# EasyEDA Pro project ProPrj_Dolphin 3D.epro, board PCB3
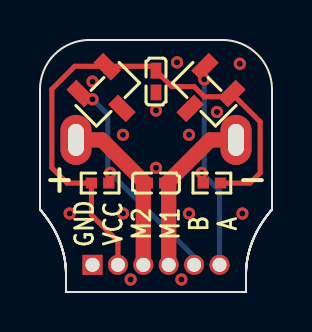
[diagram p7: board, top side]
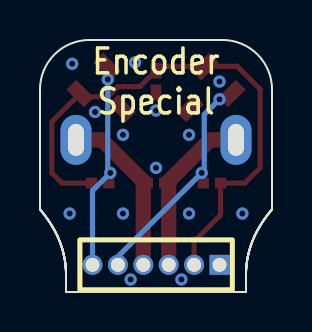
[diagram p8: board, bottom side, seen from below]

Outline 11.6 x 12.61 mm; copper layers: Top Layer, Bottom Layer. Coordinates in mm from the lower left corner of the outline.
Outline path: 0,10.13 arc(0.72,11.89) 2.48,12.61 9.12,12.61 arc(10.88,11.89) 11.6,10.14 11.6,4.13 11.57,4.09 11.52,4.04 11.5,4.01 11.47,3.98 11.45,3.95 11.41,3.89 11.37,3.84 11.35,3.82 11.32,3.78 11.3,3.76 11.26,3.7 11.23,3.65 11.21,3.63 11.19,3.6 11.17,3.57 11.15,3.54 11.13,3.51 11.1,3.46 11.08,3.43 11.05,3.39 11.03,3.35 11.02,3.34 10.99,3.29 10.95,3.22 10.93,3.19 10.91,3.15 10.89,3.11 10.87,3.08 10.86,3.05 10.84,3.03 10.82,2.99 10.8,2.94 10.78,2.89 10.76,2.85 10.74,2.82 10.71,2.75 10.69,2.7 10.67,2.66 10.65,2.61 10.63,2.58 10.62,2.55 10.6,2.5 10.59,2.47 10.58,2.44 10.57,2.41 10.55,2.36 10.53,2.3 10.52,2.26 10.51,2.23 10.5,2.19 10.49,2.15 10.48,2.12 10.45,2.03 10.44,1.98 10.43,1.94 10.42,1.9 10.4,1.8 10.39,1.76 10.38,1.72 10.37,1.69 10.36,1.58 10.35,1.55 10.35,1.52 10.34,1.47 10.34,1.43 10.33,1.37 10.33,1.35 10.32,1.3 10.32,1.25 10.31,1.21 10.31,1.18 10.3,1.05 10.3,1 10.3,0.95 10.3,0.92 10.3,0.87 10.3,0 1.3,0 1.3,0.91 1.3,0.95 1.3,0.99 1.3,1.04 1.29,1.17 1.29,1.22 1.28,1.24 1.28,1.29 1.27,1.34 1.27,1.36 1.27,1.42 1.26,1.46 1.26,1.5 1.25,1.54 1.23,1.64 1.23,1.67 1.22,1.7 1.21,1.75 1.2,1.79 1.18,1.89 1.17,1.93 1.16,1.97 1.16,2 1.14,2.07 1.12,2.14 1.11,2.18 1.1,2.2 1.09,2.23 1.08,2.25 1.07,2.29 1.05,2.35 1.04,2.39 1.02,2.43 1.01,2.45 1,2.49 0.98,2.54 0.97,2.57 0.95,2.62 0.94,2.65 0.93,2.67 0.9,2.72 0.88,2.77 0.85,2.84 0.82,2.9 0.81,2.93 0.78,2.98 0.77,3 0.75,3.04 0.73,3.07 0.73,3.09 0.7,3.13 0.68,3.17 0.65,3.21 0.61,3.28 0.59,3.32 0.58,3.34 0.56,3.37 0.54,3.4 0.53,3.42 0.51,3.44 0.5,3.47 0.48,3.5 0.46,3.53 0.43,3.57 0.41,3.59 0.4,3.62 0.36,3.67 0.33,3.72 0.3,3.76 0.27,3.79 0.25,3.82 0.21,3.87 0.19,3.9 0.14,3.96 0.12,3.98 0.1,4.02 0.06,4.06 0.02,4.11 0,4.13 0,10.13
Stack: Top Layer 0.035mm - / Dielectric1 0.91mm FR4 er 4.5 / Bottom Layer 0.035mm -

## Design rules (mm)
template: JLCPCB Capability(Two Layers Board)
spacing copperThickness1oz (default): track to track 0.102, other pairs 0.152 to 0.3
spacing copperThickness2oz: track to track 0.203, other pairs 0.152 to 0.3
track width copperThickness1oz (default): min 0.127, default 0.254, max 2.54
track width copperThickness2oz: min 0.203, default 0.254, max 2.54
differential pair differentialPair (default): width min 0.127, default 0.254, max 2.54; gap min 0.152, default 0.152
via viaSize (default): diameter min 0.5, default 0.61, max 10; hole min 0.3, default 0.305, max 6.3

## Placement (name value [footprint] x y rotation side)
C1  1uF  [C0402]  5.8 10.53 270 top
C2  100nF  [C0402]  5.8 5.45 180 top
NOREF  -  [Pad_e77]  9.8 7.61 0 top
NOREF#2  -  [Pad_e4]  1.8 7.61 0 top
R1  2.2kΩ  [R0402]  8.59 5.45 180 top
R2  2.2kΩ  [R0402]  3.01 5.45 0 top
U1  DRV5013ADQDBZR  [SOT-23-3_L2.9-W1.3-P1.90-LS2.4-BR]  8.21 9.9 45 top
U2  DRV5013ADQDBZR  [SOT-23-3_L2.9-W1.3-P1.90-LS2.4-BR]  3.39 9.9 135 top
U3  PZ127-1-06-Z  [HDR-TH_6P-P1.27-V-M]  5.8 1.36 0 bottom

## Footprints (pads in the part's own frame, mm; a bottom-side part is the same pattern mirrored in y, then rotated)
C0402
  rect 0.79x0.54 smd: 1(-0.545,0) 2(0.545,0)
HDR-TH_6P-P1.27-V-M
  rect 1x1 hole 0.7: 1(-3.175,0)
  round 1 hole 0.7: 2(-1.905,0) 3(-0.635,0) 4(0.635,0) 5(1.905,0) 6(3.175,0)
Pad_e4
  oval 1.55x2.5 hole 0.8x1.6: 1(0,0)
Pad_e77
  oval 1.55x2.5 hole 0.8x1.6: 1(0,0)
R0402
  rect 0.566x0.54 smd: 1(-0.433,0) 2(0.433,0)
SOT-23-3_L2.9-W1.3-P1.90-LS2.4-BR
  rect 1.25x0.7 smd: 1(1,-0.95) 2(1,0.95) 3(-1,0)

## Nets
GND: C1.2 U1.3 U2.3 U3.1
VCC: C1.1 R1.1 R2.1 U1.1 U2.1 U3.2
A: R1.2 U1.2 U3.6
B: R2.2 U2.2 U3.5
M1: C2.1 NOREF.1 U3.4
M2: C2.2 NOREF#2.1 U3.3

## Via types
v1: diameter 0.61, hole 0.305, Top Layer to Bottom Layer, 18 vias

## Routing (per net, layer and track width the routed paths; a pad name or vN(x,y) marks a point on that pad's centre or on a via; arc(x,y) is an arc through that point)
GND:
  vias: v1(1.48,3.93) v1(2.62,10.53) v1(4.15,7.87) v1(4.15,3.93) v1(4.53,0.63) v1(5.8,9.08) v1(5.8,6.21) v1(6.85,11.49) v1(7.07,0.63) v1(7.45,7.87) v1(7.45,3.93) v1(8.85,9.01) v1(9.99,11.42) v1(10.12,3.93)
VCC: length 27.8
  Top Layer w0.254: 3.33,11.29 1.74,11.29 0.59,10.15 0.59,6.21 1.36,5.45 R2.1 2.57,3.85 3.9,2.53 U3.2 ; 3.33,11.29 5.58,11.29 C1.1 6.6,10.28 7.71,10.28 8.21,9.77 9.43,9.77 U1.1 11.01,8.52 11.01,5.96 10.5,5.45 R1.1 ; 3.33,11.29 U2.1
A: length 10.2
  Top Layer w0.254: 8.16,5.45 8.16,5.89 v1(8.09,5.96)
  Bottom Layer w0.254: U3.6 8.98,5.07 v1(8.09,5.96) 8.21,6.09 v1(8.21,10.64)
B: length 10.9
  Top Layer w0.254: 3.44,5.45 3.44,5.89 v1(3.51,5.96)
  Bottom Layer w0.254: v1(2.62,9.64) 3.39,8.88 3.39,6.09 v1(3.51,5.96) 7.71,1.77 U3.5
M1: length 8.3
  Top Layer w0.762: 9.6,7.61 8.5,7.61 C2.1 6.44,5.36 U3.4
M2: length 8.3
  Top Layer w0.762: 2,7.61 3.1,7.61 C2.2 5.17,5.36 U3.3

## Copper pours and planes (outline as drawn; the poured copper is in the pictures)
GND on Top Layer: -0.68,12.95 12.53,12.95 12.53,-1.02 -0.68,-1.02
GND on Bottom Layer: -0.93,13.33 11.9,13.33 11.9,-0.77 -0.93,-0.77

## Text on the board
Bottom Silkscreen Layer: Encoder / Special
Top Silkscreen Layer: GND / VCC / M2 / M1 / B / A | + | -
